# EasyEDA Pro project ProDocument_Low Cost_2023-07-23.epro

# Schematic Schematic1_3
Create Date: 2023-07-18; Page Name: P1; Project Name: 39CASTIC; Schematic Name: Schematic1_3; Update Date: 2023-07-19; Add into BOM: yes; Company: 深圳嘉立创科技发展有限公司; Convert to PCB: yes; Drawed: 嘉立创EDA; Page Size: A3; Part Number: JLCPCB-001; Reviewed: 嘉立创EDA; Version: V0.1
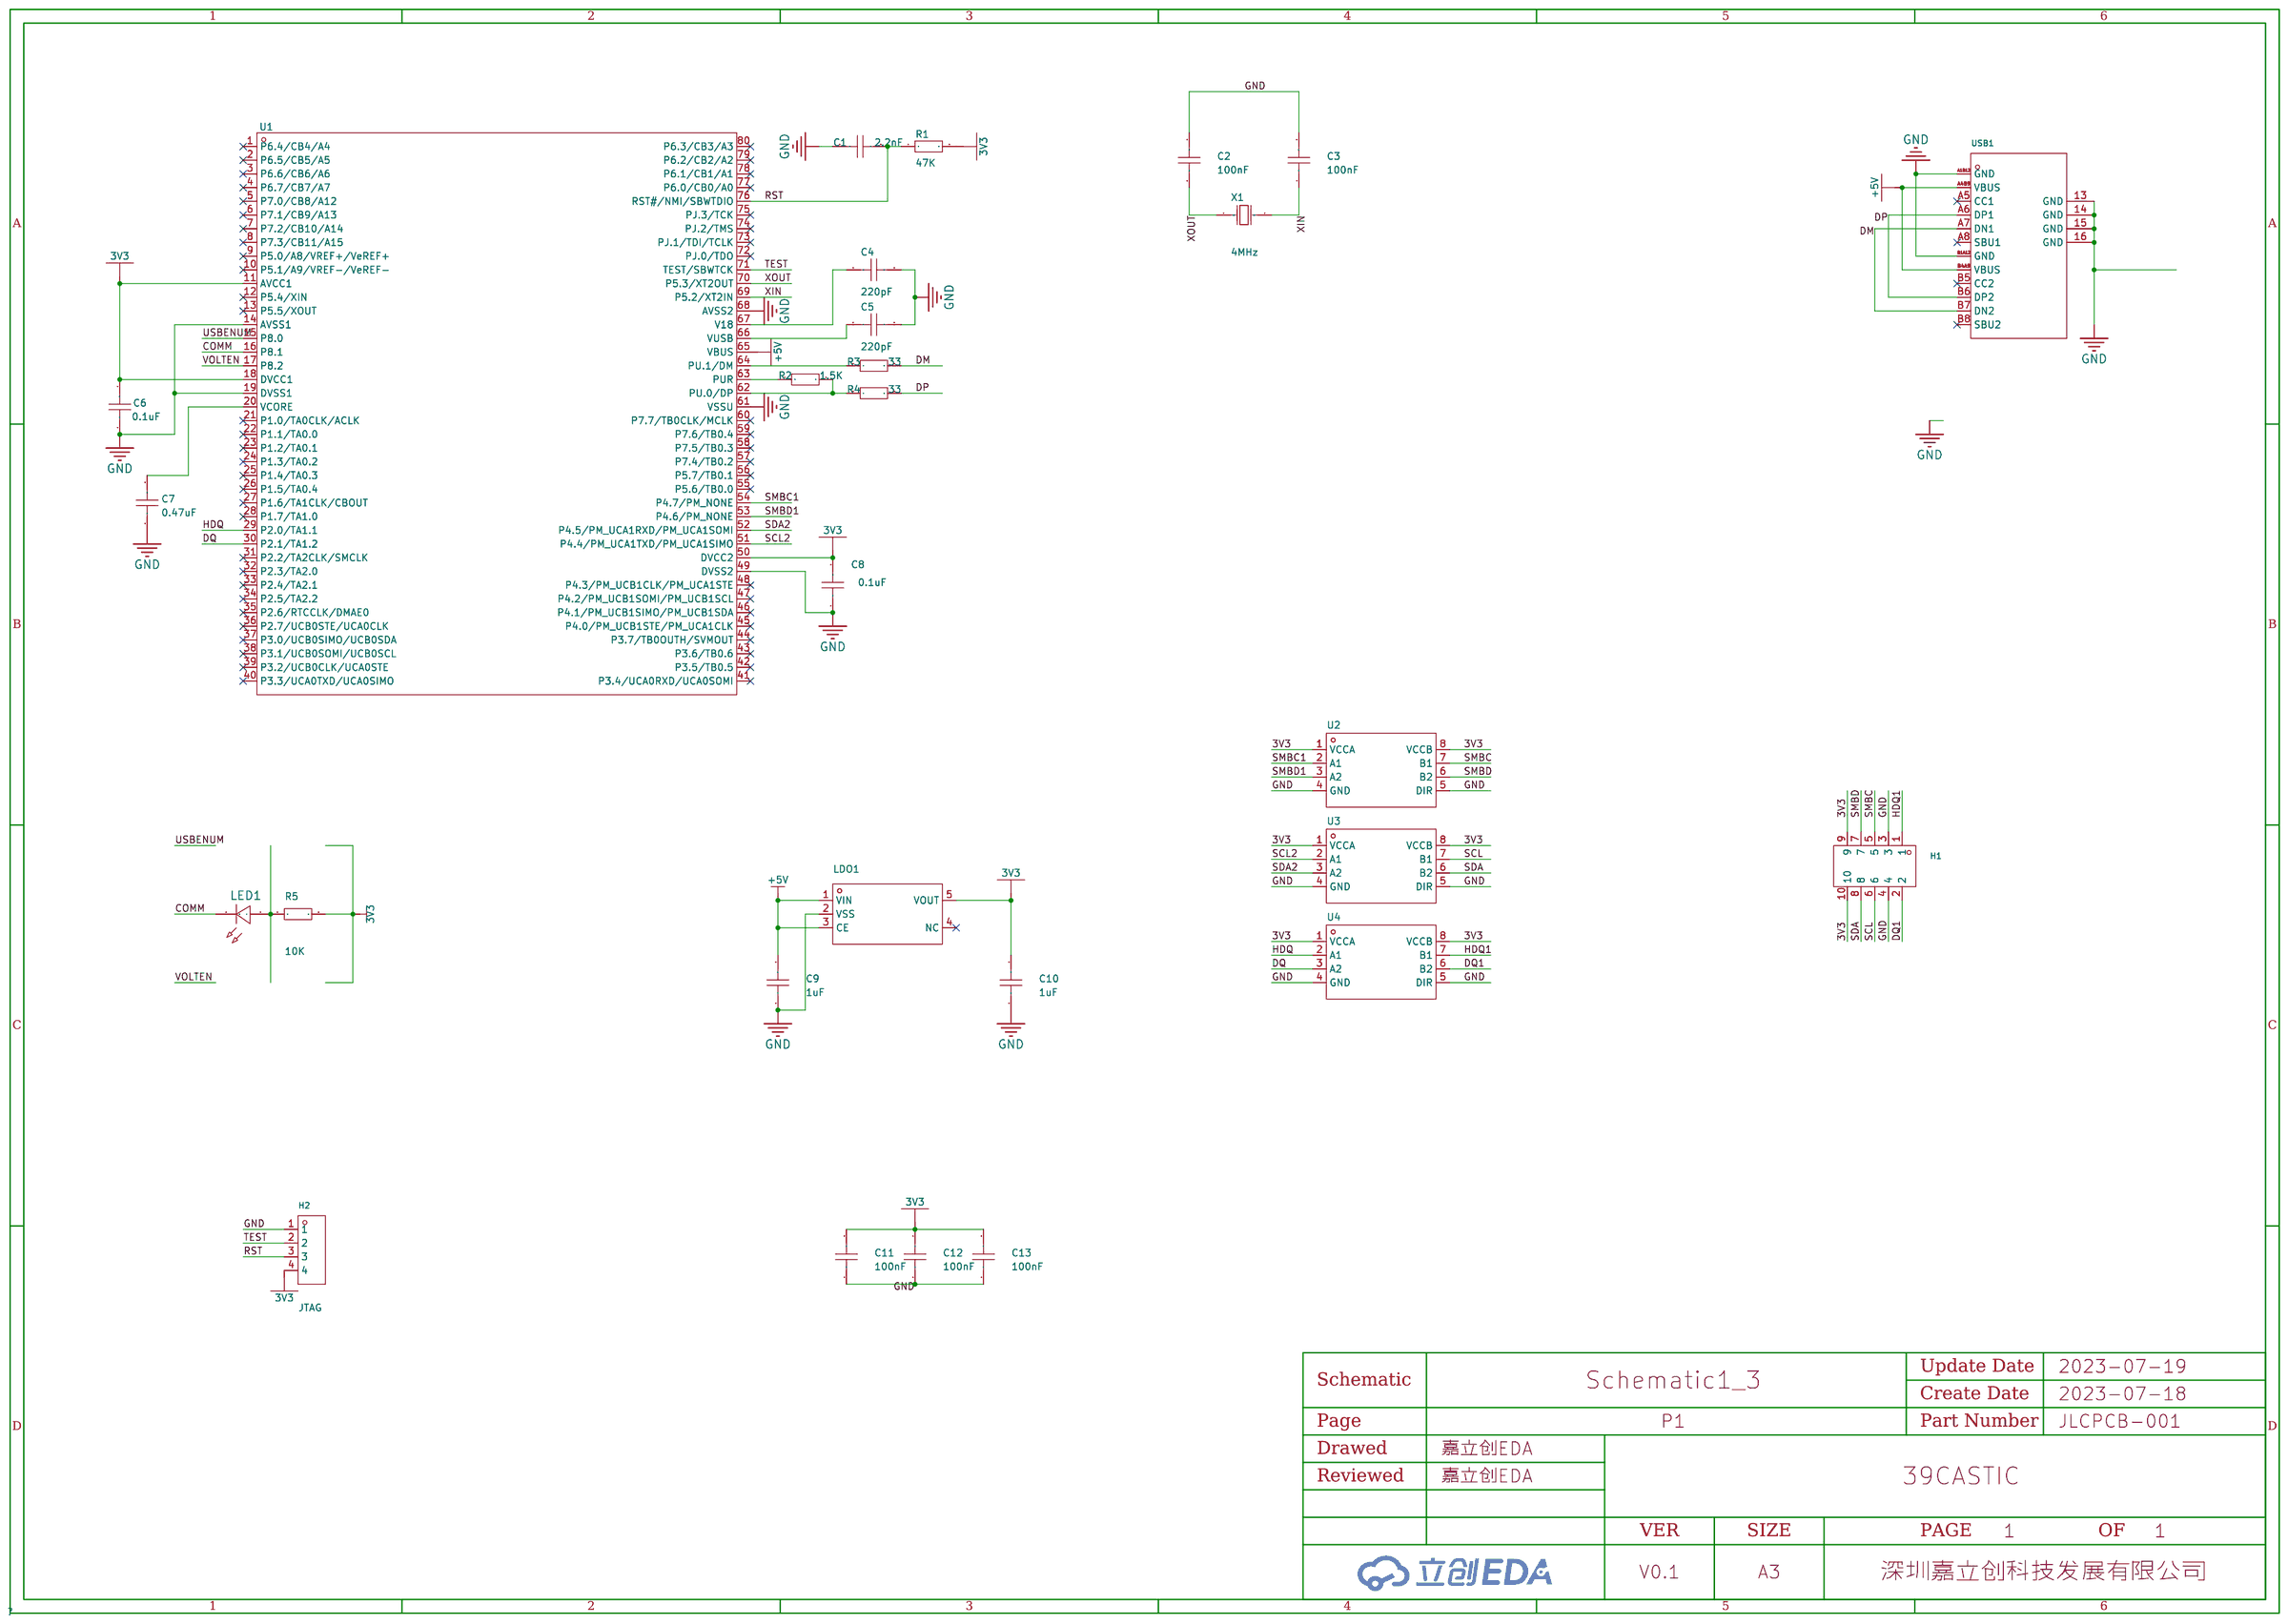
[diagram p0: schematic sheet]

## Parts
C1  2.2nF  [C0603_1]
C2  100nF  [C0603]
C3  100nF  [C0603]
C4  220pF  [C0603_1]
C5  220pF  [C0603_1]
C6  0.1uF  [C0603_1]
C7  0.47uF  [C0603_1]
C8  0.1uF  [C0603_1]
C9  1uF  [C0603]
C10  1uF  [C0603]
C11  100nF  [C0603]
C12  100nF  [C0603]
C13  100nF  [C0603]
H1  PZ254V-12-10P  [HDR-TH_10P-P2.54-V-M-R2-C5-S2.54]
H2  JTAG  [HDR-TH_4P-P2.54-V-F]
LDO1  ME6211C33M5G-N  [SOT-23-5_L3.0-W1.7-P0.95-LS2.8-BL]
LED1  -  [LED_0603]
R1  47K  [R0603_1]
R2  1.5K  [R0603_1]
R3  33  [R0603_1]
R4  33  [R0603_1]
R5  10K  [R0603]
U1  -  [LQFP-80_L12.0-W12.0-P0.50-LS14.0-BL]
U2  SN74LVC2T45DCUR  [VSSOP-8_L2.4-W2.1-P0.50-LS3.2-BR]
U3  SN74LVC2T45DCUR  [VSSOP-8_L2.4-W2.1-P0.50-LS3.2-BR]
U4  SN74LVC2T45DCUR  [VSSOP-8_L2.4-W2.1-P0.50-LS3.2-BR]
USB1  TYPEC-304-BCP16  [USB-C-SMD_TYPEC-304-BCP16]
X1  4MHz  [HC-49US_L11.5-W4.5-P4.88]

## Library data of the parts
C1 C4-C8 = CAP_604: 容值:100nF;精度:±10%;额定电压:50V;温度系数:X7R;; Supplier Footprint: 0603
C2 C3 C9-C13 = CAP_0603: Supplier Footprint: 0603
H1 = PZ254V-12-10P: 排数:双排;总PIN位数:10;间距:2.54mm;插针结构:2x5P;行距:2.54mm;安装类型:直插;圆针/方针:方针;额定电流:-;额定电压:-;配合针长度:6mm;塑高:2.5mm;端接针长度:3mm;触头材质:黄铜;触头镀层:-;工作温度范围:-40℃~+105℃;颜色:黑色;; LCSC Part Name: 2.54mm 2x5P 直插 方针; Supplier Part: C492422; Manufacturer: XFCN(兴飞); Supplier Footprint: 直插,P=2.54mm; JLCPCB Part Class: 扩展库; Supplier: LCSC; Number of Rows: 双排; Number of Pins: 10; Pitch: 2.54mm; Pin Structure: 2x5P; Row Spacing: 2.54mm; Mounting Type: 直插; Circluar Pins/Square Pins: 方针; Length of Mating Pin: 6mm; Insulation Height: 2.5mm; Length of End Connection Pin: 3mm; Contact Material: 黄铜; Operating Temperature Range: -40℃~+105℃; Color: 黑色
H2 = HDR-F_2.54_1x4P: Supplier Part: C2718488; Supplier Footprint: 插件
LDO1 = ME6211C33M5G-N: 输出类型:固定;输出极性:正;最大输入电压:6V;输出电压:3.3V;输出电流:500mA;电源纹波抑制比(PSRR):70dB;; Supplier Part: C82942; Manufacturer: MICRONE(南京微盟); Supplier Footprint: SOT-23-5; JLCPCB Part Class: 扩展库; Datasheet: https://atta.szlcsc.com/upload/public/pdf/source/20170918/C82942_1505727073070976520.pdf; Supplier: LCSC; Output Type: 固定; Output Polarity: 正; Number of Outputs: 1; Maximum Input Voltage: 6V; Output Voltage: 3.3V; Dropout Voltage: 260mV@(200mA); Output Current: 500mA; Power Supply Rejection Ratio (PSRR): 70dB
LED1 = LED_0603-R: Supplier Footprint: 0603
R1-R4 = Res_604: Supplier Footprint: 0603
R5 = Res_0603: Supplier Footprint: 0603
U1 = MSP430F5529IPN: CPU位数:-;ROM类型:-;CPU内核:-;主频（MAX):-;工作电压:-;; Supplier Part: C75712; Manufacturer: TI(德州仪器); Supplier Footprint: LQFP-80; JLCPCB Part Class: Extended Part; Datasheet: https://atta.szlcsc.com/upload/public/pdf/source/20180528/C75712_042792AAA7951DA6306D06E7842A7EC0.pdf; Supplier: LCSC
U2-U4 = SN74LVC2T45DCUR: SN74LVC2T45 具有可配置电压转换和三态输出的 2 位双电源总线收发器; Supplier Part: C15741; Manufacturer: TI(德州仪器); Supplier Footprint: VSSOP-8-0.5mm; JLCPCB Part Class: Extended Part; Datasheet: https://atta.szlcsc.com/upload/public/pdf/source/20140711/1457707145874.pdf; Supplier: LCSC
USB1 = TYPEC-304-BCP16_C720629: 连接器类型:Type-C;标准:USB 3.1;公母:母座;触点数量:16;端口数量:1;安装方式:卧贴;额定电流 - 电源:3A;工作温度范围:-25℃~+85℃;焊接温度(最大值):260℃;; LCSC Part Name: Type-C 母座 卧贴 停产; Supplier Part: C720629; Manufacturer: XUNPU(讯普); Supplier Footprint: SMD; JLCPCB Part Class: Extended Part; Supplier: LCSC; Connector Type: Type-C; Standard: USB 3.1; Gender: 母座; Number of Contacts: 16; Number of Ports: 1; Mounting Style: 卧贴; Current Rating - Power (Max): 3A; Operating Temperature Range: -25℃~+85℃; Welding Temperature (Max): 260℃
X1 = X49SD4MSD2SC: 频率:4MHz;频率公差:±20ppm;负载电容:20pF;; LCSC Part Name: 4MHz ±20ppm 20pF HC-49US; Supplier Part: C13761; Manufacturer: YXC(扬兴晶振); Supplier Footprint: HC-49S; JLCPCB Part Class: 扩展库; Datasheet: https://atta.szlcsc.com/upload/public/pdf/source/20210903/A997D130AE99CBB55D9024F9BE6DA174.pdf; Supplier: LCSC; Crystal Type: 49S晶振; Frequency Tolerance: ±20ppm; Frequency Stability: ±30ppm; Load Capacitance: 20pF; Operating Temperature: -20℃~+70℃

## Nets
3V3: C6.2 C8.2 C10.2 C11.2 C12.2 C13.2 H1.9 H1.10 H2.4 LDO1.5(VOUT) R1.2 R5.2 U1.11(AVCC1) U1.18(DVCC1) U1.50(DVCC2) U2.1(VCCA) U2.8(VCCB) U3.1(VCCA) U3.8(VCCB) U4.1(VCCA) U4.8(VCCB)
+5V: C9.2 LDO1.1(VIN) LDO1.3(CE) U1.65(VBUS) USB1.A4B9(VBUS) USB1.B4A9(VBUS)
GND: C1.1 C2.2 C3.2 C4.2 C5.2 C6.1 C7.1 C8.1 C9.1 C10.1 C11.1 C12.1 C13.1 H1.3 H1.4 H2.1 LDO1.2(VSS) U1.14(AVSS1) U1.19(DVSS1) U1.49(DVSS2) U1.61(VSSU) U1.68(AVSS2) U2.4(GND) U2.5(DIR) U3.4(GND) U3.5(DIR) U4.4(GND) U4.5(DIR) USB1.13(GND) USB1.14(GND) USB1.15(GND) USB1.16(GND) USB1.A1B12(GND) USB1.B1A12(GND)
COMM: LED1.1(C) U1.16(P8.1)
DM: R3.2 USB1.A7(DN1) USB1.B7(DN2)
DP: R4.2 USB1.A6(DP1) USB1.B6(DP2)
DQ: U1.30(P2.1/TA1.2) U4.3(A2)
DQ1: H1.2 U4.6(B2)
HDQ: U1.29(P2.0/TA1.1) U4.2(A1)
HDQ1: H1.1 U4.7(B1)
RST: C1.2 H2.3 R1.1 U1.76(RST#/NMI/SBWTDIO)
SCL: H1.6 U3.7(B1)
SCL2: U1.51(P4.4/PM_UCA1TXD/PM_UCA1SIMO) U3.2(A1)
SDA: H1.8 U3.6(B2)
SDA2: U1.52(P4.5/PM_UCA1RXD/PM_UCA1SOMI) U3.3(A2)
SMBC: H1.5 U2.7(B1)
SMBC1: U1.54(P4.7/PM_NONE) U2.2(A1)
SMBD: H1.7 U2.6(B2)
SMBD1: U1.53(P4.6/PM_NONE) U2.3(A2)
TEST: H2.2 U1.71(TEST/SBWTCK)
USBENUM: U1.15(P8.0)
VOLTEN: U1.17(P8.2)
XIN: C3.1 U1.69(P5.2/XT2IN) X1.1(OSC1)
XOUT: C2.1 U1.70(P5.3/XT2OUT) X1.2(OSC2)
$1N1515: C7.2 U1.20(VCORE)
$1N2214: R2.2 R4.1 U1.62(PU.0/DP)
$1N2405: R2.1 U1.63(PUR)
$1N2629: R3.1 U1.64(PU.1/DM)
$1N2974: C5.1 U1.66(VUSB)
$1N2990: C4.1 U1.67(V18)
$1N11086: LED1.2(A) R5.1

Not connected (* = marked no-connect by the designer): LDO1 4(NC)*; U1 1(P6.4/CB4/A4)* 2(P6.5/CB5/A5)* 3(P6.6/CB6/A6)* 4(P6.7/CB7/A7)* 5(P7.0/CB8/A12)* 6(P7.1/CB9/A13)* 7(P7.2/CB10/A14)* 8(P7.3/CB11/A15)* 9(P5.0/A8/VREF+/VeREF+)* 10(P5.1/A9/VREF-/VeREF-)* 12(P5.4/XIN)* 13(P5.5/XOUT)* 21(P1.0/TA0CLK/ACLK)* 22(P1.1/TA0.0)* 23(P1.2/TA0.1)* 24(P1.3/TA0.2)* 25(P1.4/TA0.3)* 26(P1.5/TA0.4)* 27(P1.6/TA1CLK/CBOUT)* 28(P1.7/TA1.0)* 31(P2.2/TA2CLK/SMCLK)* 32(P2.3/TA2.0)* 33(P2.4/TA2.1)* 34(P2.5/TA2.2)* 35(P2.6/RTCCLK/DMAE0)* 36(P2.7/UCB0STE/UCA0CLK)* 37(P3.0/UCB0SIMO/UCB0SDA)* 38(P3.1/UCB0SOMI/UCB0SCL)* 39(P3.2/UCB0CLK/UCA0STE)* 40(P3.3/UCA0TXD/UCA0SIMO)* 41(P3.4/UCA0RXD/UCA0SOMI)* 42(P3.5/TB0.5)* 43(P3.6/TB0.6)* 44(P3.7/TB0OUTH/SVMOUT)* 45(P4.0/PM_UCB1STE/PM_UCA1CLK)* 46(P4.1/PM_UCB1SIMO/PM_UCB1SDA)* 47(P4.2/PM_UCB1SOMI/PM_UCB1SCL)* 48(P4.3/PM_UCB1CLK/PM_UCA1STE)* 55(P5.6/TB0.0)* 56(P5.7/TB0.1)* 57(P7.4/TB0.2)* 58(P7.5/TB0.3)* 59(P7.6/TB0.4)* 60(P7.7/TB0CLK/MCLK)* 72(PJ.0/TDO)* 73(PJ.1/TDI/TCLK)* 74(PJ.2/TMS)* 75(PJ.3/TCK)* 77(P6.0/CB0/A0)* 78(P6.1/CB1/A1)* 79(P6.2/CB2/A2)* 80(P6.3/CB3/A3)*; USB1 A5(CC1)* A8(SBU1)* B5(CC2)* B8(SBU2)*

# Board PCB1_3
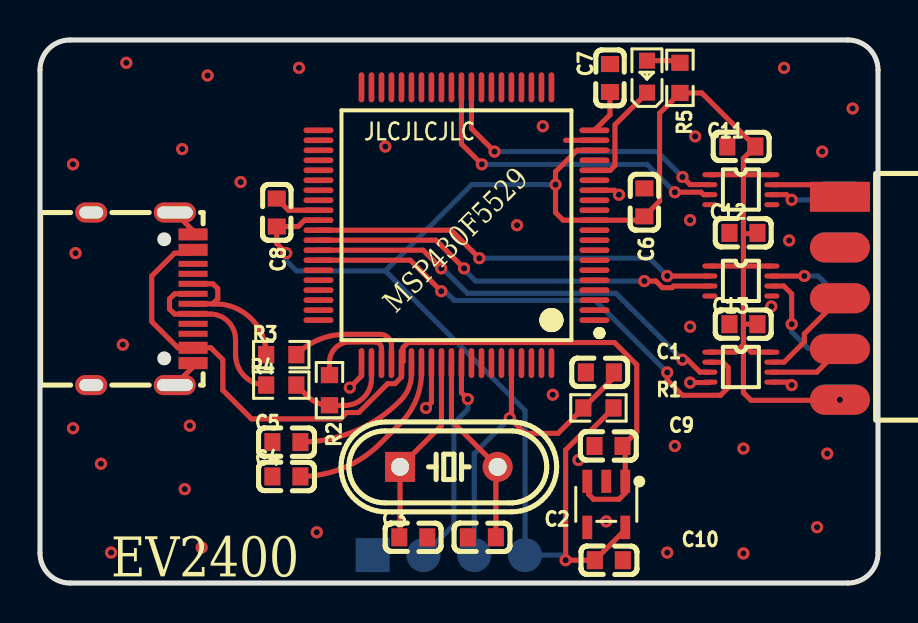
[diagram p1: board, top side]
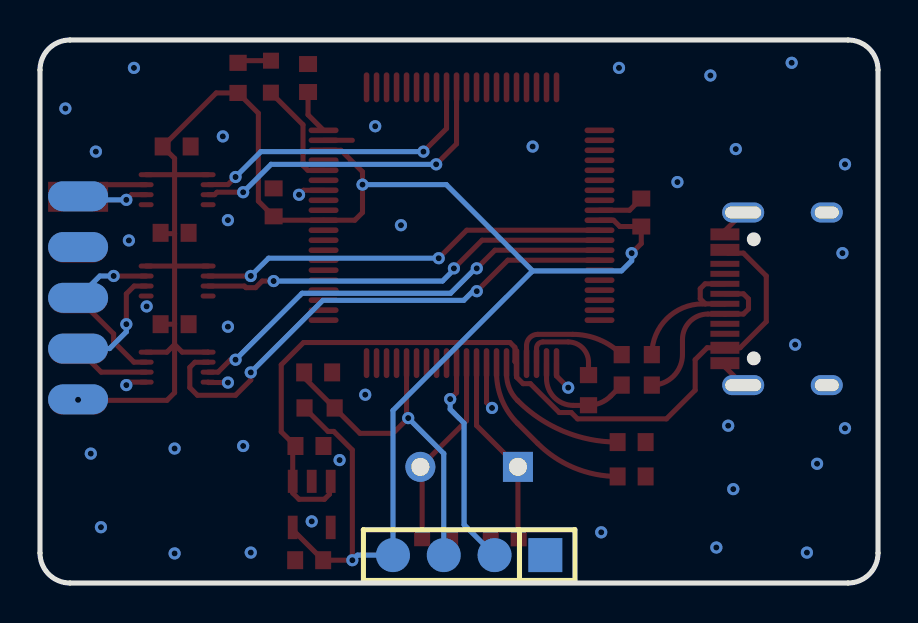
[diagram p2: board, bottom side, seen from below]

Outline 41.91 x 27.18 mm; copper layers: Top Layer, Bottom Layer. Coordinates in mm from the lower left corner of the outline.
Outline path: 0,25.68 0,1.5 arc(0.44,0.44) 1.5,0 40.41,0 arc(41.47,0.44) 41.91,1.5 41.91,25.68 arc(41.47,26.74) 40.41,27.18 1.5,27.18 arc(0.44,26.74) 0,25.68
Stack: Top Layer 0.035mm / Dielectric1 1.51mm FR4 er 4.5 / Bottom Layer 0.035mm

## Design rules (mm)
net DP: DP2
net DM: DP2
template: JLCPCB Capability(Two Layers Board)
spacing copperThickness1oz (default): track to track 0.102, other pairs 0.152 to 0.3
spacing copperThickness2oz: track to track 0.203, other pairs 0.152 to 0.3
track width copperThickness1oz (default): min 0.127, default 0.254, max 2.54
track width copperThickness2oz: min 0.203, default 0.254, max 2.54
differential pair differentialPair (default): width min 0.127, default 0.254, max 2.54; gap min 0.152, default 0.152
via viaSize (default): diameter min 0.5, default 0.61, max 10; hole min 0.3, default 0.305, max 6.3

## Placement (name value [footprint] x y rotation side)
C1  2.2nF  [C0603_1]  28 10.54 0 top
C2  100nF  [C0603]  22.1 2.29 180 top
C3  100nF  [C0603]  18.67 2.29 0 top
C4  220pF  [C0603_1]  12.32 5.33 180 top
C5  220pF  [C0603_1]  12.32 7.05 180 top
C6  0.1uF  [C0603_1]  30.23 19.05 270 top
C7  0.47uF  [C0603_1]  28.5 25.27 270 top
C8  0.1uF  [C0603_1]  11.84 18.54 270 top
C9  1uF  [C0603]  28.43 6.86 0 top
C10  1uF  [C0603]  28.45 1.14 180 top
C11  100nF  [C0603]  35.08 21.85 0 top
C12  100nF  [C0603]  35.18 17.53 0 top
C13  100nF  [C0603]  35.18 12.95 0 top
H1  PZ254V-12-10P  [HDR-TH_10P-P2.54-V-M-R2-C5-S2.54]  41.28 14.25 270 top
H2  JTAG  [HDR-TH_4P-P2.54-V-F]  20.45 1.4 0 bottom
LDO1  ME6211C33M5G-N  [SOT-23-5_L3.0-W1.7-P0.95-LS2.8-BL]  28.32 3.94 180 top
LED1  -  [LED_0603]  30.35 25.39 90 top
R1  47K  [R0603_1]  27.93 8.76 0 top
R2  1.5K  [R0603_1]  14.48 9.65 270 top
R3  33  [R0603_1]  12.07 11.43 180 top
R4  33  [R0603_1]  12.07 9.91 180 top
R5  10K  [R0603]  32 25.28 270 top
U1  -  [LQFP-80_L12.0-W12.0-P0.50-LS14.0-BL]  20.83 17.91 90 top
U2  SN74LVC2T45DCUR  [VSSOP-8_L2.4-W2.1-P0.50-LS3.2-BR]  35.05 10.8 180 top
U3  SN74LVC2T45DCUR  [VSSOP-8_L2.4-W2.1-P0.50-LS3.2-BR]  35.05 15.11 180 top
U4  SN74LVC2T45DCUR  [VSSOP-8_L2.4-W2.1-P0.50-LS3.2-BR]  35.05 19.69 180 top
USB1  TYPEC-304-BCP16  [USB-C-SMD_TYPEC-304-BCP16]  5.11 14.22 270 top
X1  4MHz  [HC-49US_L11.5-W4.5-P4.88]  20.45 5.81 0 top

## Footprints (pads in the part's own frame, mm; a bottom-side part is the same pattern mirrored in y, then rotated)
C0603
  rect 0.8x0.9 smd: 1(-0.7,0) 2(0.7,0)
C0603_1
  rect 0.8x0.9 smd: 1(-0.7,0) 2(0.7,0)
HC-49US_L11.5-W4.5-P4.88
  rect 1.5x1.5 hole 0.9: 1(-2.44,0)
  round 1.5 hole 0.9: 2(2.44,0)
HDR-TH_4P-P2.54-V-F
  rect 1.7x1.7 smd: 1(-3.81,0)
  round 1.7 smd: 2(-1.27,0) 3(1.27,0) 4(3.81,0)
HDR-TH_10P-P2.54-V-M-R2-C5-S2.54
  rect 1.5x3 smd: 1(-5.08,-1.27)
  oval 1.5x3 smd far side: 2(-5.106,-1.27) 4(-2.566,-1.27) 6(-0.025,-1.27) 8(2.514,-1.27) 10(5.054,-1.27)
  oval 1.5x3 smd: 3(-2.54,-1.27) 5(0,-1.27) 7(2.54,-1.27) 9(5.08,-1.27)
LED_0603
  rect 0.8x0.8 smd: 1(-0.851,-0.01) 2(0.75,-0.005)
LQFP-80_L12.0-W12.0-P0.50-LS14.0-BL
  oval 0.28x1.5 smd: 1(-4.75,-6.9) 2(-4.25,-6.9) 3(-3.75,-6.9) 4(-3.25,-6.9) 5(-2.75,-6.9) 6(-2.25,-6.9) 7(-1.75,-6.9) 8(-1.25,-6.9) 9(-0.75,-6.9) 10(-0.25,-6.9) 11(0.25,-6.9) 12(0.75,-6.9) 13(1.25,-6.9) 14(1.75,-6.9) 15(2.25,-6.9) 16(2.75,-6.9) 17(3.25,-6.9) 18(3.75,-6.9) 19(4.25,-6.9) 20(4.75,-6.9) 41(4.75,6.9) 42(4.25,6.9) 43(3.75,6.9) 44(3.25,6.9) 45(2.75,6.9) 46(2.25,6.9) 47(1.75,6.9) 48(1.25,6.9) 49(0.75,6.9) 50(0.25,6.9) 51(-0.25,6.9) 52(-0.75,6.9) 53(-1.25,6.9) 54(-1.75,6.9) 55(-2.25,6.9) 56(-2.75,6.9) 57(-3.25,6.9) 58(-3.75,6.9) 59(-4.25,6.9) 60(-4.75,6.9)
  oval 1.5x0.28 smd: 21(6.9,-4.75) 22(6.9,-4.25) 23(6.9,-3.75) 24(6.9,-3.25) 25(6.9,-2.75) 26(6.9,-2.25) 27(6.9,-1.75) 28(6.9,-1.25) 29(6.9,-0.75) 30(6.9,-0.25) 31(6.9,0.25) 32(6.9,0.75) 33(6.9,1.25) 34(6.9,1.75) 35(6.9,2.25) 36(6.9,2.75) 37(6.9,3.25) 38(6.9,3.75) 39(6.9,4.25) 40(6.9,4.75) 61(-6.9,4.75) 62(-6.9,4.25) 63(-6.9,3.75) 64(-6.9,3.25) 65(-6.9,2.75) 66(-6.9,2.25) 67(-6.9,1.75) 68(-6.9,1.25) 69(-6.9,0.75) 70(-6.9,0.25) 71(-6.9,-0.25) 72(-6.9,-0.75) 73(-6.9,-1.25) 74(-6.9,-1.75) 75(-6.9,-2.25) 76(-6.9,-2.75) 77(-6.9,-3.25) 78(-6.9,-3.75) 79(-6.9,-4.25) 80(-6.9,-4.75)
R0603
  rect 0.806x0.864 smd: 1(-0.753,0) 2(0.753,0)
R0603_1
  rect 0.806x0.864 smd: 1(-0.753,0) 2(0.753,0)
SOT-23-5_L3.0-W1.7-P0.95-LS2.8-BL
  rect 0.49x1.157 smd: 1(-0.95,-1.153) 2(0,-1.153) 3(0.95,-1.153)
  rect 0.49x1.175 smd: 4(0.95,1.153) 5(-0.95,1.153)
USB-C-SMD_TYPEC-304-BCP16
  oval 1x2.1 hole 0.6x1.8: 13(-4.32,1.633) 14(4.32,1.633)
  oval 1x1.6 hole 0.6x1.2: 15(-4.32,-2.547) 16(4.32,-2.547)
  rect 0.6x1.45 smd: A1B12(-3.225,2.547) A4B9(-2.45,2.547) B1A12(3.22,2.547) B4A9(2.45,2.547)
  rect 0.3x1.45 smd: A5(-1.25,2.547) A6(-0.25,2.547) A7(0.25,2.547) A8(1.25,2.547) B5(1.75,2.547) B6(0.75,2.547) B7(-0.75,2.547) B8(-1.75,2.547)
VSSOP-8_L2.4-W2.1-P0.50-LS3.2-BR
  oval 0.75x0.25 smd: 1(1.55,-0.75) 2(1.55,-0.25) 3(1.55,0.25) 4(1.55,0.75) 5(-1.55,0.75) 6(-1.55,0.25) 7(-1.55,-0.25) 8(-1.55,-0.75)

## Nets
As in the schematic.

Pads without a net: LDO1 4; U1 1 2 3 4 5 6 7 8 9 10 12 13 21 22 23 24 25 26 27 28 31 32 33 34 35 36 37 38 39 40 41 42 43 44 45 46 47 48 55 56 57 58 59 60 72 73 74 75 77 78 79 80; USB1 A5 A8 B5 B8

## Via types
v1: diameter 0.61, hole 0.305, Top Layer to Bottom Layer, 61 vias

## Routing (per net, layer and track width the routed paths; a pad name or vN(x,y) marks a point on that pad's centre or on a via; arc(x,y) is an arc through that point)
3V3: length 101
  Top Layer w0.254: v1(12.32,16.51) 11.84,16.99 C8.2 12.91,17.84 13.23,18.16 U1.50 ; C12.2 35.84,17.48 35.18,17.48 ; 35.18,15.86 35.18,12.97 ; 35.18,15.86 U3.8 ; 35.18,15.86 35.18,17.48 ; 35.18,15.86 U3.1 ; 35.18,12.97 35.2,12.95 C13.2 ; 35.18,12.97 35.18,11.94 ; 35.18,11.94 35.18,9.53 35.56,9.14 39.98,9.14 v1(40.01,9.17) ; 35.18,11.94 34.8,11.56 33.51,11.56 U2.1 ; 35.18,11.94 35.56,11.55 U2.8 ; 35.18,20.44 U4.8 ; 35.18,20.44 35.18,21.25 C11.2 33.09,24.53 R5.2 30.99,23.51 30.99,19.11 C6.2 ; 35.18,20.44 35.18,17.48 ; 35.18,20.44 U4.1 ; 30.35,18.35 30.16,18.16 U1.11 26.17,18.16 25.78,18.54 v1(25.78,19.94) 25.78,20.58 26.86,21.66 U1.18 ; R1.2 27.51,7.59 27.22,7.59 26.29,6.66 v1(26.29,1.14) C10.2 29.27,2.67 LDO1.5
  Bottom Layer w0.254: v1(26.29,1.14) 26.04,1.4 H2.4 24.26,8.64 17.27,15.62 ; v1(12.32,16.51) 12.32,16.13 12.83,15.62 17.27,15.62 ; 17.27,15.62 21.59,19.94 v1(25.78,19.94)
+5V: length 44.4
  Top Layer w0.254: USB1.A4B9 7.49,16.51 6.73,16.51 5.59,15.37 5.59,13.08 6.9,11.77 USB1.B4A9 8.55,11.77 9.14,11.18 9.14,9.65 10.58,8.22 15.03,8.22 15.34,8.53 15.94,8.53 17.39,9.98 17.75,9.98 18.08,10.3 U1.65 18.16,11.09 18.16,11.79 18.4,12.04 28.73,12.04 29.85,10.92 29.85,7.57 C9.2 29.27,6.72 LDO1.1 29.27,4.51 28.96,4.19 27.69,4.19 27.43,4.45 27.43,5.03 27.37,5.09
GND: length 13.9
  Top Layer w0.254: C8.1 12.42,18.66 U1.49 ; USB1.B1A12 7.66,10.82 USB1.14 ; USB1.A1B12 7.66,17.63 USB1.13 ; v1(15.49,9.78) 16.08,10.36 U1.61 ; v1(19.3,8.76) 19.58,9.04 U1.68 ; v1(37.59,9.91) 37.44,10.05 U2.5 ; v1(32.51,10.03) 33.48,10.03 U2.4 ; U1.19 26.29,22.16 ; U1.14 28.73,19.66 v1(28.96,19.43)
  vias: v1(1.65,20.95) v1(1.65,7.75) v1(1.78,16.51) v1(3.05,5.97) v1(3.56,1.52) v1(4.14,11.93) v1(4.32,26.04) v1(7.11,21.72) v1(7.24,4.7) v1(7.49,7.87) v1(8.09,1.78) v1(8.38,25.4) v1(10.03,20.07) v1(12.95,25.78) v1(13.84,2.54) v1(17.27,21.84) v1(23.86,17.91) v1(25.15,22.86) v1(25.64,9.42) v1(26.93,6.15) v1(28.32,3.09) v1(31.37,1.52) v1(31.75,6.86) v1(32.51,18.16) v1(32.51,12.83) v1(32.77,22.35) v1(35.18,6.73) v1(35.18,1.48) v1(36.58,13.84) v1(37.21,25.78) v1(37.47,17.15) v1(38.86,2.79) v1(39.12,21.59) v1(39.37,6.48) v1(40.64,23.75)
COMM: length 5.4
  Top Layer w0.254: LED1.1 28.76,22.94 28.76,20.9 28.52,20.66 U1.16
DM: length 7.3
  Top Layer w0.254: 8.64,13.97 7.66,13.97 USB1.A7 ; 8.64,13.97 8.77,13.97 arc(10.57,13.23) R3.2 ; 8.64,13.97 8.89,14.22 8.89,14.73 8.65,14.97 USB1.B7
DP: length 9.1
  Top Layer w0.254: USB1.A6 6.73,14.47 6.48,14.22 6.48,13.72 6.73,13.46 7.65,13.46 ; 7.65,13.46 8.51,13.46 arc(9.41,13.09) 9.78,12.19 9.78,11.44 arc(10.23,10.35) R4.2 ; 7.65,13.46 USB1.B6
DQ: length 16.3
  Top Layer w0.254: U4.3 33.18,19.44 33.06,19.56 v1(31.75,19.56) ; U1.30 21.08,21.98 v1(22.1,20.95)
  Bottom Layer w0.254: v1(22.1,20.95) 30.35,20.95 v1(31.75,19.56)
DQ1: length 3.6
  Top Layer w0.254: U4.6 37.33,19.44 v1(37.59,19.18)
  Bottom Layer w0.254: v1(37.59,19.18) 39.83,19.18 40.01,19.35
HDQ: length 15.1
  Top Layer w0.254: v1(22.73,21.59) 21.58,22.75 U1.29 ; 33.46,19.94 32.51,19.94 v1(32.13,20.32)
  Bottom Layer w0.254: v1(32.13,20.32) 30.86,21.59 v1(22.73,21.59)
HDQ1: length 3.7
  Top Layer w0.254: 40.01,19.33 39.4,19.94 U4.7
RST: length 17.3
  Top Layer w0.254: C1.2 28.7,10.28 27.17,8.76 ; 27.17,8.76 25.91,7.49 24.26,7.49 v1(23.5,8.26) 23.58,8.34 U1.76 ; 27.17,8.76 R1.1
  Bottom Layer w0.254: H2.3 21.72,6.48 v1(23.5,8.26)
SCL: length 3.9
  Top Layer w0.254: v1(38.23,15.37) 38.22,15.36 U3.7
  Bottom Layer w0.254: 40.01,14.27 38.91,15.37 v1(38.23,15.37)
SCL2: length 20.5
  Top Layer w0.254: v1(21.97,16.26) 20.57,17.66 U1.51 ; v1(31.37,15.37) 31.37,15.36 U3.2
  Bottom Layer w0.254: v1(31.37,15.37) 30.48,16.26 v1(21.97,16.26)
SDA: length 5.8
  Top Layer w0.254: U3.6 37.2,14.86 37.59,14.47 v1(37.59,12.95)
  Bottom Layer w0.254: v1(37.59,12.95) 37.59,12.57 38.43,11.73 40.01,11.73
SDA2: length 20.6
  Top Layer w0.254: U1.52 19.8,17.16 v1(21.21,15.75) ; U3.3 31.69,14.86 31.61,14.78 31.13,14.78 30.8,15.11 v1(30.23,15.11)
  Bottom Layer w0.254: v1(30.23,15.11) 21.78,15.11 21.21,15.68 v1(21.21,15.75)
SMBC: length 5
  Top Layer w0.254: 40.01,14.25 38.23,12.47 38.23,12.07 37.21,11.05 U2.7
SMBC1: length 25.7
  Top Layer w0.254: U1.54 18.51,16.16 v1(20.07,14.61) ; U2.2 33.51,11.05 34.16,11.05 34.42,10.8 34.42,9.78 34.03,9.4 32.13,9.4 31.37,10.16 v1(31.37,10.54)
  Bottom Layer w0.254: v1(20.07,14.61) 20.26,14.61 20.71,14.15 27.76,14.15 v1(31.37,10.54)
SMBD: length 3.9
  Top Layer w0.254: U2.6 38.85,10.55 40.01,11.71
SMBD1: length 22.1
  Top Layer w0.254: v1(32.13,11.18) 32.39,11.18 33.01,10.55 U2.3 ; v1(20.07,15.75) 19.16,16.66 U1.53
  Bottom Layer w0.254: v1(32.13,11.18) 28.8,14.5 21.37,14.5 20.13,15.75 v1(20.07,15.75)
TEST: length 10.7
  Top Layer w0.254: U1.71 21.08,9.52 v1(21.4,9.2)
  Bottom Layer w0.254: v1(21.4,9.2) 21.4,8.7 20.7,8 20.7,2.92 19.18,1.4
XIN: length 9.6
  Top Layer w0.254: U1.69 20.08,7.88 X1.1 18.01,2.32 C3.1
XOUT: length 9.7
  Top Layer w0.254: U1.70 20.58,8.12 X1.2 22.8,5.72 C2.1
$1N1515: length 2.2
  Top Layer w0.254: U1.20 28.5,23.43 C7.2
$1N2214: length 5.7
  Top Layer w0.254: U1.62 16.58,10.23 arc(16.19,9.28) 15.24,8.89 14.49,8.89 arc(14.48,8.89) R2.2 arc(13.88,9.02) 13.36,9.36 R4.1
$1N2405: length 4.7
  Top Layer w0.254: R2.1 14.48,11.05 arc(14.78,11.77) 15.49,12.06 16.76,12.06 arc(16.99,11.97) 17.08,11.75 U1.63
$1N2629: length 6.2
  Top Layer w0.254: U1.64 17.58,11.89 arc(17.41,12.28) 17.02,12.45 15.27,12.45 arc(13.94,12.18) R3.1
$1N2974: length 7.6
  Top Layer w0.254: U1.66 18.58,10.46 arc(18.44,9.75) 18.03,9.14 18.01,9.12 arc(15.72,7.59) C5.1
$1N2990: length 9.2
  Top Layer w0.254: U1.67 19.08,10.52 arc(18.81,9.16) 18.03,8 17.03,6.99 arc(15.19,5.76) C4.1
$1N11086: length 1.7
  Top Layer w0.254: LED1.2 31.9,26.14 R5.1

## Copper pours and planes (outline as drawn; the poured copper is in the pictures)
GND on Top Layer: -19.56,37.08 54.61,37.08 54.61,-11.05 -19.56,-11.05
GND on Bottom Layer: -19.68,39.18 54.48,39.18 54.48,-8.95 -19.68,-8.95

## Text on the board
Top Silkscreen Layer: JLCJLCJLC | MSP430F5529 | EV2400
